# Altium schematic sheet STM32F407 Controller.SchDoc
size A4; DocumentNumber: 9; SheetNumber: 9; SheetTotal: 11
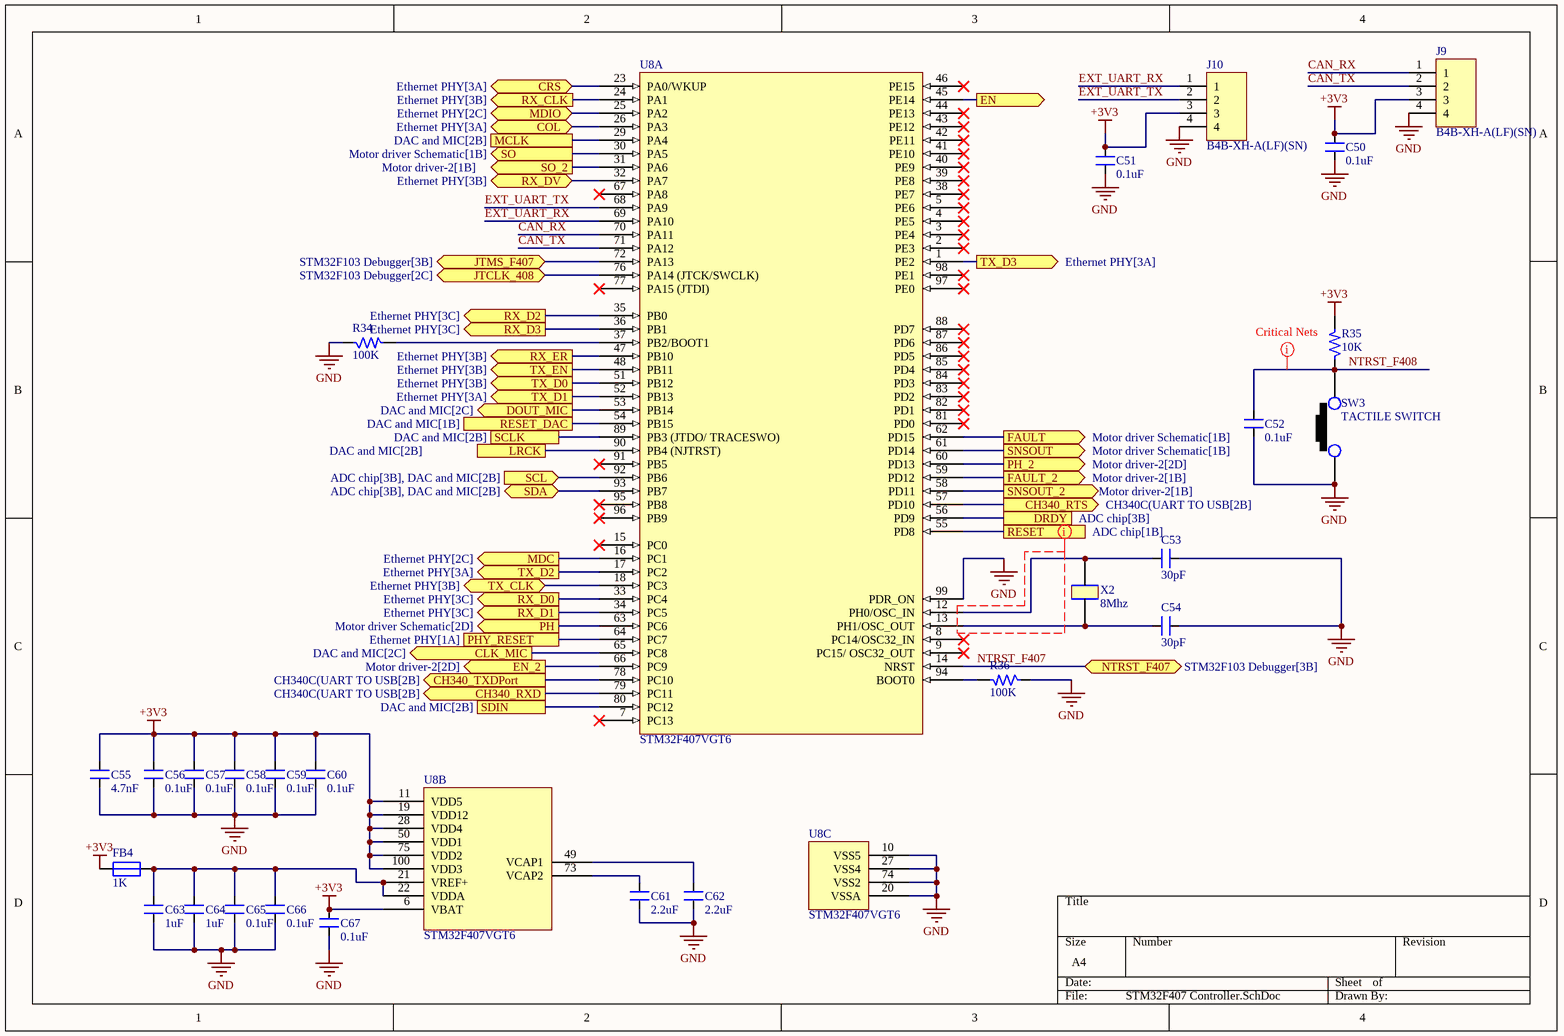
[diagram p0: STM32F407 Controller.SchDoc]

## Parts
C50  0.1uF  [CAP_0805]
C51  0.1uF  [CAP_0805]
C52  0.1uF  [CAP_0805]
C53  30pF  [CAP_0805]
C54  30pF  [CAP_0805]
C55  4.7nF  [CAP_0805]
C56  0.1uF  [CAP_0805]
C57  0.1uF  [CAP_0805]
C58  0.1uF  [CAP_0805]
C59  0.1uF  [CAP_0805]
C60  0.1uF  [CAP_0805]
C61  2.2uF  [CAP_0805]
C62  2.2uF  [CAP_0805]
C63  1uF  [CAP_0805]
C64  1uF  [CAP_0805]
C65  0.1uF  [CAP_0805]
C66  0.1uF  [CAP_0805]
C67  0.1uF  [CAP_0805]
FB4  1K  [IND_0805]
J9  B4B-XH-A(LF)(SN)  [CON4_100_B4B-XH-A_TH_ST]
J10  B4B-XH-A(LF)(SN)  [CON4_100_B4B-XH-A_TH_ST]
R34  100K  [RES_0603]
R35  10K  [RES_0603]
R36  100K  [RES_0603]
SW3  TACTILE SWITCH  [SW_342_SMD]
U8  STM32F407VGT6  [QFN100_19.6_669_58X10_SMD]  (parts A,B,C of 3)
X2  8Mhz  [XTAL_314_240X47_SMD]

## Ports
CH340_RTS (out, see CH340C(UART TO USB[2B]), CH340_RXD (out, see CH340C(UART TO USB[2B]), CH340_TXDPort (out, see CH340C(UART TO USB[2B]), CLK_MIC (out, see DAC and MIC[2C]), COL (bidir, see Ethernet PHY[3A]), CRS (bidir, see Ethernet PHY[3A]), DOUT_MIC (out, see DAC and MIC[2C]), DRDY (see ADC chip[3B]), EN (out, see Motor driver Schematic[2D]), EN_2 (out, see Motor driver-2[2D]), FAULT (out, see Motor driver Schematic[1B]), FAULT_2 (out, see Motor driver-2[1B]), JTCLK_408 (bidir, see STM32F103 Debugger[2C]), JTMS_F407 (bidir, see STM32F103 Debugger[3B]), LRCK (see DAC and MIC[2B]), MCLK (see DAC and MIC[2B]), MDC (out, see Ethernet PHY[2C]), MDIO (bidir, see Ethernet PHY[2C]), NTRST_F407 (bidir, see STM32F103 Debugger[3B]), PH (out, see Motor driver Schematic[2D]), PH_2 (out, see Motor driver-2[2D]), PHY_RESET (see Ethernet PHY[1A]), RESET (see ADC chip[1B]), RESET_DAC (see DAC and MIC[1B]), RX_CLK (out, see Ethernet PHY[3B]), RX_D0 (out, see Ethernet PHY[3C]), RX_D1 (out, see Ethernet PHY[3C]), RX_D2 (out, see Ethernet PHY[3C]), RX_D3 (out, see Ethernet PHY[3C]), RX_DV (bidir, see Ethernet PHY[3B]), RX_ER (out, see Ethernet PHY[3B]), SCL (in, see ADC chip[3B], DAC and MIC[2B]), SCLK (see DAC and MIC[2B]), SDA (bidir, see ADC chip[3B], DAC and MIC[2B]), SDIN (see DAC and MIC[2B]), SNSOUT (out, see Motor driver Schematic[1B]), SNSOUT_2 (out, see Motor driver-2[1B]), SO (out, see Motor driver Schematic[1B]), SO_2 (out, see Motor driver-2[1B]), TX_CLK (bidir, see Ethernet PHY[3B]), TX_D0 (out, see Ethernet PHY[3B]), TX_D1 (out, see Ethernet PHY[3A]), TX_D2 (out, see Ethernet PHY[3A]), TX_D3 (out, see Ethernet PHY[3A]), TX_EN (out, see Ethernet PHY[3B])

## Nets
+3V3: C50.2 C51.2 C55.2 C56.2 C57.2 C58.2 C59.2 C60.2 C67.2 FB4.1 J9.3 J10.3 R35.2 U8.6(VBAT) U8.11(VDD5) U8.19(VDD12) U8.28(VDD4) U8.50(VDD1) U8.75(VDD2) U8.100(VDD3)
GND: C50.1 C51.1 C52.1 C53.1 C54.1 C55.1 C56.1 C57.1 C58.1 C59.1 C60.1 C61.1 C62.1 C63.1 C64.1 C65.1 C66.1 C67.1 J9.4 J10.4 R34.1 R36.1 SW3.1 U8.10(VSS5) U8.20(VSSA) U8.27(VSS4) U8.74(VSS2) U8.99(PDR_ON)
CAN_RX: J9.1 U8.70(PA11)
CAN_TX: J9.2 U8.71(PA12)
CH340_RTS: U8.57(PD10) ; port CH340_RTS
CH340_RXD: U8.79(PC11) ; port CH340_RXD
CH340_TXDPort: U8.78(PC10) ; port CH340_TXDPort
CLK_MIC: U8.65(PC8) ; port CLK_MIC
COL: U8.26(PA3) ; port COL
CRS: U8.23(PA0/WKUP) ; port CRS
DOUT_MIC: U8.53(PB14) ; port DOUT_MIC
DRDY: U8.56(PD9) ; port DRDY
EN: U8.45(PE14) ; port EN
EN_2: U8.66(PC9) ; port EN_2
EXT_UART_RX: J10.1 U8.69(PA10)
EXT_UART_TX: J10.2 U8.68(PA9)
FAULT: U8.62(PD15) ; port FAULT
FAULT_2: U8.59(PD12) ; port FAULT_2
JTCLK_408: U8.76(PA14_(JTCK/SWCLK)) ; port JTCLK_408
JTMS_F407: U8.72(PA13) ; port JTMS_F407
LRCK: U8.90(PB4_(NJTRST)) ; port LRCK
MCLK: U8.29(PA4) ; port MCLK
MDC: U8.16(PC1) ; port MDC
MDIO: U8.25(PA2) ; port MDIO
NTRST_F407: U8.14(NRST) ; port NTRST_F407
NTRST_F408: C52.2 R35.1 SW3.2
PH: U8.63(PC6) ; port PH
PH_2: U8.60(PD13) ; port PH_2
PHY_RESET: U8.64(PC7) ; port PHY_RESET
RESET: U8.55(PD8) ; port RESET
RESET_DAC: U8.54(PB15) ; port RESET_DAC
RX_CLK: U8.24(PA1) ; port RX_CLK
RX_D0: U8.33(PC4) ; port RX_D0
RX_D1: U8.34(PC5) ; port RX_D1
RX_D2: U8.35(PB0) ; port RX_D2
RX_D3: U8.36(PB1) ; port RX_D3
RX_DV: U8.32(PA7) ; port RX_DV
RX_ER: U8.47(PB10) ; port RX_ER
SCL: U8.92(PB6) ; port SCL
SCLK: U8.89(PB3_(JTDO/_TRACESWO)) ; port SCLK
SDA: U8.93(PB7) ; port SDA
SDIN: U8.80(PC12) ; port SDIN
SNSOUT: U8.61(PD14) ; port SNSOUT
SNSOUT_2: U8.58(PD11) ; port SNSOUT_2
SO: U8.30(PA5) ; port SO
SO_2: U8.31(PA6) ; port SO_2
TX_CLK: U8.18(PC3) ; port TX_CLK
TX_D0: U8.51(PB12) ; port TX_D0
TX_D1: U8.52(PB13) ; port TX_D1
TX_D2: U8.17(PC2) ; port TX_D2
TX_D3: U8.1(PE2) ; port TX_D3
TX_EN: U8.48(PB11) ; port TX_EN
NetC53_2: C53.2 U8.12(PH0/OSC_IN) X2.2
NetC54_2: C54.2 U8.13(PH1/OSC_OUT) X2.1
NetC61_2: C61.2 U8.73(VCAP2)
NetC62_2: C62.2 U8.49(VCAP1)
NetC63_2: C63.2 C64.2 C65.2 C66.2 FB4.2 U8.21(VREF+) U8.22(VDDA)
NetR34_2: R34.2 U8.37(PB2/BOOT1)
NetR36_2: R36.2 U8.94(BOOT0)

Not connected (* = marked no-connect by the designer): U8 2(PE3)* 3(PE4)* 4(PE5)* 5(PE6)* 7(PC13)* 8(PC14/OSC32_IN)* 9(PC15/_OSC32_OUT)* 15(PC0)* 38(PE7)* 39(PE8)* 40(PE9)* 41(PE10)* 42(PE11)* 43(PE12)* 44(PE13)* 46(PE15)* 67(PA8)* 77(PA15_(JTDI))* 81(PD0)* 82(PD1)* 83(PD2)* 84(PD3)* 85(PD4)* 86(PD5)* 87(PD6)* 88(PD7)* 91(PB5)* 95(PB8)* 96(PB9)* 97(PE0)* 98(PE1)*

## Layout directives
net class OSC_Nets: GND
net class Critical Nets: NTRST_F408

## Library data of the parts
C50-C52 = CAP_0.1uF-50V-10%-0805: 0.1µF ±10% 50V Ceramic Capacitor X7R 0805 (2012 Metric); Manufacturer: Samsung; Manufacturer Part Number: CL21B104KBCNNNC; Alternate Part Number-1: NA; Case/Package: 0805; Supplier-1: SIRICOM; Supplier Part Number-1: 0805B104K500CT
C53 C54 = CAP_30pF-50V-10%-0805: ±10% 50V Ceramic Capacitor C0G, NP0 0805 (2012 Metric); Manufacturer Part Number: C0805C300K5GAC7800; Manufacturer: KEMET; Alternate Part Number: NA; Case/Package: 0805; Supplier-1: Digikey; Supplier Part Number-1: 399-17443-1-ND - Cut Tape (CT)
C55 = CAP_4.7nF-50V-10%-0805: 4700pF ±10% 50V Ceramic Capacitor X7R 0805 (2012 Metric); Manufacturer: TDK; Manufacturer Part Number: C0805C472K5RECAUTO; Alternate Part Number-1: NA; Case/Package: 0805; Supplier-1: SIRICOM; Supplier Part Number-1: 0805N472J500LT
C56-C60 C65-C67 = CAP_0.1uF-50V-5%-0805: 0.1µF ±5% 50V Ceramic Capacitor X7R 0805 (2012 Metric); Manufacturer: AVX Corporation; Manufacturer Part Number: 08055C104JAT4A; Alternate Part Number-1: 0805B104M500; Case/Package: 0805; Supplier-1: SIRICOM; Supplier Part Number-1: 0805B104J500CT
C61 C62 = CAP_2.2uF-25V-10%-0805: 2.2µF ±10% 25V Ceramic Capacitor X7R 0805 (2012 Metric); Manufacturer: KEMET; Manufacturer Part Number: CL21B225KAFNFNE; Alternate Part Number-1: NA; Case/Package: 0805; Supplier-1: SIRICOM; Supplier Part Number-1: CL21A225KAFNNNE
C63 C64 = CAP_1uF-50V-5%-0805: 1µF ±5% 50V Ceramic Capacitor X7R 0805 (2012 Metric); Manufacturer: Samsung; Manufacturer Part Number: CC0805JKX7R9BB105; Alternate Part Number-1: 0805F105M500NT; Case/Package: 0805; Supplier-1: SIRICOM; Supplier Part Number-1: CL21B105KBFNNNE
FB4 = FB_1K-100MHZ-1.6A-0805: 1 kOhms @ 100MHz 1 Power Line Ferrite Bead 0805 (2012 Metric) 1.6A; Manufacturer: Laird; Manufacturer Part Number: BLM21SP102SH1D; Alternate Part Number-1: NA; Case/Package: 0805; Supplier-1: SIRICOM; Supplier Part Number-1: ACMS201209A102
J9 J10 = CON-PLG_4X1-100-ST-TH: 4 Pins, 1 Row 2.54mm Pitch, straight Connector, male; Manufacturer: Wurth Electronics; Mating Part Number: XHP-4; Crimp Part Number: ASXHSXH22K51; Alternate Part Number-1: NA; Manufacturer Part Number: B4B-XH-A(LF)(SN); Case/Package: TH-CON; Supplier-1: LCSC; Supplier Part Number-1: B4B-XH-A(LF)(SN)
R34 R36 = RES_100K-0.1W-1%-0603: 100 kOhms ±1% 0.1W, 1/10W Chip Resistor 0603 (1608 Metric) Automotive AEC-Q200 Thick Film; Manufacturer: Stackpole Electronics; Manufacturer Part Number: RMCF0603FT100K; Alternate Part Number-1: NA; Case/Package: 0603; Supplier-1: Arrow; Supplier Part Number-1: RMCF0603FT100K
R35 = RES_10K-0.1W-1%-0603: 10 kOhms ±1% 0.1W, 1/10W Chip Resistor 0603 (1608 Metric) Automotive AEC-Q200 Thick Film; Manufacturer: Walsin; Manufacturer Part Number: WR06X1002FTL; Alternate Part Number-1: 0603WAJ0103T5E; Case/Package: 0603; Supplier-1: SIRICOM; Supplier Part Number-1: WR06X1002FTL
SW3 = SW1_RS-282G05A3-SMRT-SMD: Tactile Switch SPST-NO Top Actuated Surface Mount; Manufacturer: ITT C&K; Alternate Part Number-1: NA; Manufacturer Part Number: RS-282G05A3-SMRT; Case/Package: SMD; Supplier-1: SP ROAD; Supplier Part Number-1: RS-282G05A3-SMRT
U8 = IC_STM32F407VGT6: ARM® Cortex®-M4 STM32F4 Microcontroller IC 32-Bit 168MHz 1MB (1M x 8) FLASH 100-LQFP (14x14); Manufacturer: STMicroelectronics; Alternate Part Number-1: STM32F407VET6; Manufacturer Part Number: STM32F407VGT6; Case/Package: LQFP100; Supplier-1: ARROW; Supplier Part Number-1: STM32F407VGT6
X2 = XTAL_8MHZ-ECS-80-32-5PX-SMD: 8MHz ±30ppm Crystal 32pF 60 Ohms HC-49/US; Manufacturer: Fox Electronics; Manufacturer Part Number: ECS-80-32-5PX-TR; Alternate Part Number-1: NA; Case/Package: SMD/SMT; Supplier-1: SP ROAD; Supplier Part Number-1: ECS-80-32-5PX-TR